# EAGLE schematic HIVDC_Startup_S3_v1p00 (EAGLE 9.6.2)

## Parts
U1  R7FS3A6783A01CFLAA0PLQP0048KB-B_REN-M  [PLQP0048KB-B_REN-M]  (not placed on a sheet)
U2  R7FS3A6783A01CFLAA0PLQP0048KB-B_REN-M  [PLQP0048KB-B_REN-M]  (not placed on a sheet)
U3  R7FS3A6783A01CFLAA0PLQP0048KB-B_REN-M  [PLQP0048KB-B_REN-M]  (not placed on a sheet)
U4  R7FS3A6783A01CFLAA0PLQP0048KB-B_REN-L  [PLQP0048KB-B_REN-L]  (not placed on a sheet)
U5  R7FS3A6783A01CFLAA0PLQP0048KB-B_REN-L  [PLQP0048KB-B_REN-L]  (not placed on a sheet)
U6  R7FS3A6783A01CFLAA0PLQP0048KB-B_REN-L  [PLQP0048KB-B_REN-L]  (not placed on a sheet)

## Library data of the parts
U1-U6 = 3D_MIG_Controller:R7FS3A6783A01CFLAA0; BUILT_BY: EMA_Jessica; COPYRIGHT: Copyright (C) 2018 Accelerated Designs. All rights reserved; MANUFACTURER_PART_NUMBER: R7FS3A6783A01CFL#AA0; SOURCELIBRARY: Renesas_2019-10-17_1; VENDOR: Renesas Electronics